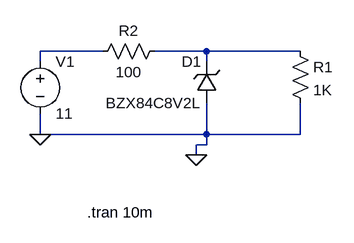
[diagram p0: schematic experiment-1(a).asc]
experiment-1(a).asc, the LTspice schematic file:
Version 4
SHEET 1 880 680
WIRE 224 336 128 336
WIRE 384 336 304 336
WIRE 528 336 384 336
WIRE 128 352 128 336
WIRE 384 352 384 336
WIRE 128 464 128 432
WIRE 384 464 384 416
WIRE 384 464 128 464
WIRE 528 464 528 416
WIRE 528 464 384 464
WIRE 384 480 384 464
WIRE 384 480 368 480
WIRE 368 496 368 480
FLAG 368 496 0
FLAG 128 464 0
SYMBOL zener 400 416 R180
WINDOW 0 24 64 Left 2
WINDOW 3 24 0 Left 2
SYMATTR InstName D1
SYMATTR Value BZX84C8V2L
SYMBOL res 512 320 R0
SYMATTR InstName R1
SYMATTR Value 1K
SYMBOL res 320 320 R90
WINDOW 0 0 56 VBottom 2
WINDOW 3 32 56 VTop 2
SYMATTR InstName R2
SYMATTR Value 100
SYMBOL voltage 128 336 R0
SYMATTR InstName V1
SYMATTR Value 11
TEXT 200 584 Left 2 !.tran 10m

The netlist it stands for:
* experiment-1(a).asc
D1 0 N002 BZX84C8V2L
R1 N002 0 1K
R2 N002 N001 100
V1 N001 0 11
.model D D
.lib standard.dio
.tran 10m
.backanno
.end